# EAGLE design tweeq-eMod_Splitter_UART (EAGLE 7.2.0)
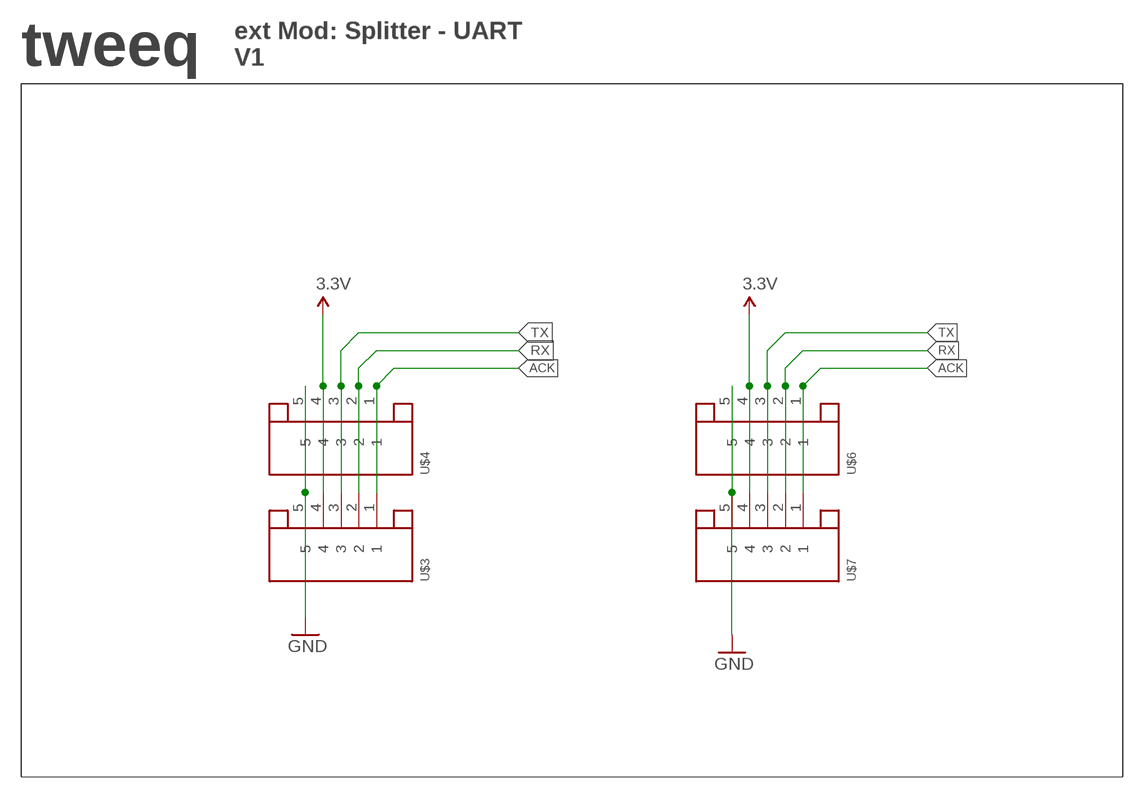
[diagram p0: schematic, sheet 1]

## Parts
U$3  JST-5PINSH  [SH1.0-5PIN]
U$4  JST-5PINSH  [SH1.0-5PIN]
U$6  JST-5PINSH  [SH1.0-5PIN]
U$7  JST-5PINSH  [SH1.0-5PIN]

## Nets
3.3V: U$3.4 U$4.4 U$6.4 U$7.4
ACK: U$3.1 U$4.1 U$6.1 U$7.1
GND: U$3.5 U$4.5 U$6.5 U$7.5
RX: U$3.2 U$4.2 U$6.2 U$7.2
TX: U$3.3 U$4.3 U$6.3 U$7.3

## Notes on the sheet
- tweeq
- ext Mod: Splitter - UART
  V1

## Library data of the parts
U$3 U$4 U$6 U$7 = AISCube:JST-5PIN: JST 5 Pin

## Board
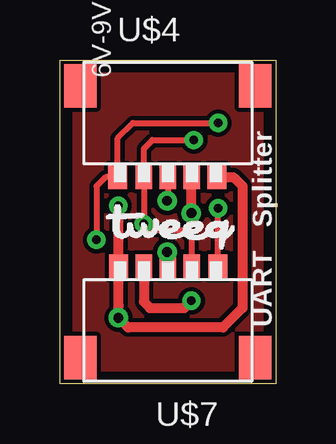
[diagram p1: board, top side]
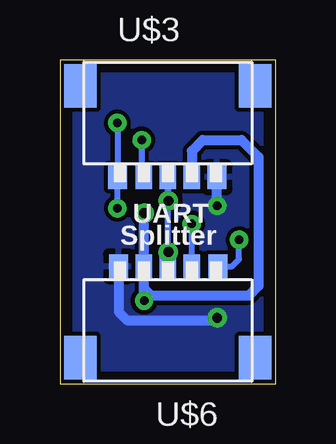
[diagram p2: board, bottom side, seen from below]

Size 9 x 13.5 mm. Coordinates in mm from the lower left corner, seen from the top.
Outline: 0,13.5 9,13.5 9,0 0,0 0,13.5
Copper layers (1*16): Top 0.0356mm / dielectric 1.5011mm / Bottom 0.0356mm
Design rules "AISCube": minimum track width 7mil, minimum drill 14mil, track to track 7mil, track to pad 7mil, pad to pad 7mil, via to via 7mil, smd to smd 0mil, copper to edge 20mil, drill to drill 8mil, minimum pad ring 10mil, minimum via ring 8mil, stop-mask expansion 4mil, vias tented up to drill 32mil, thermal gap 10mil

### Footprints (pad centres in the part's own frame; a part is rotated, then mirrored left to right if it is on the bottom)
SH1.0-5PIN = smd 0.8 x 1: 1 -2.09,-0.55; 5 2.05,-0.55 | smd 0.7 x 1: 2 -1,-0.55; 3 0,-0.55; 4 1,-0.55 | smd 1.35 x 1.8: P$1 -3.65,3.25; P$2 3.65,3.25

### Placement (x,y rotation side)
U$1  [TWEEQ-LOGO-S]  1.93,5.59 0 top
U$3  4.5,9.16 0 bottom
U$4  4.5,9.16 0 top
U$6  4.5,4.34 180 bottom
U$7  4.5,4.34 180 top

### Tracks (layer width: path | path; a pad name or v marks a point on that pad's centre or on a via)
3.3V  (via drill 0.36, 0.41)
  Top 0.406: v5.49,7.11 5.49,8.6 U$4.4 | U$7.4 3.5,3.41 3.76,3.15 5.18,3.15 v5.49,3.45
  Bottom 0.406: v5.49,3.45 5.49,3.96 | 5.49,3.96 5.49,4.87 U$6.4 5.5,7.1 v5.49,7.11 | 5.49,3.96 5.18,3.66 1.12,3.66 0.71,4.06 0.71,9.45 1.42,10.16 3.05,10.16 3.5,9.71 U$3.4
ACK  (via drill 0.36)
  Top 0.254: U$7.1 6.59,7.3 v6.6,7.32 | v6.6,10.87 3.05,10.87 2.41,10.23 U$4.1 1.91,8.61 1.52,8.23 v1.52,5.99
  Bottom 0.254: v6.6,7.32 6.6,8.6 U$3.1 6.6,8.63 v6.6,10.87 | 2.4,4.88 U$6.1 1.82,4.89 1.52,5.18 v1.52,5.99
GND  (via drill 0.36, 0.41)
  Top 0.406: v2.44,7.42 2.45,7.41 U$7.5 2.45,3.24 v2.44,2.74 2.85,2.34 6.81,2.34 7.62,3.15 7.62,8.23 7.24,8.61 U$4.5
  Bottom 0.406: U$6.5 6.55,2.99 6.2,2.64 2.54,2.64 v2.44,2.74 | v2.44,7.42 2.44,8.6 U$3.5
  pour Bottom: 0.1,0.2 8.84,0.2 8.84,13.31 0.1,13.31
N$1
  pour Top: 0.1,0.2 8.84,0.2 8.84,13.31 0.1,13.31
RX  (via drill 0.36)
  Top 0.254: U$7.2 5.49,4.9 5.49,6.1 5.18,6.4 3.76,6.4 v3.5,6.66 U$4.2 3.5,9.8 3.86,10.16 v5.59,10.16
  Bottom 0.254: U$6.2 v3.5,6.66 | v5.59,10.16 5.59,8.7 U$3.2
TX  (via drill 0.41)
  Top 0.254: U$3.3 4.5,7.65 v4.47,7.62 | U$7.3 4.5,5.46 v4.47,5.49
  Bottom 0.254: v4.47,7.62 4.5,7.65 U$3.3 U$7.3 4.47,4.92 v4.47,5.49
  Bottom 0.406: 4.47,8.58 U$3.3

### Text on the board
tPlace: Splitter | UART
bPlace: UART | Splitter
tNames: 6V-9V DC | ON
bNames: Breadboard | V-Reg | Module